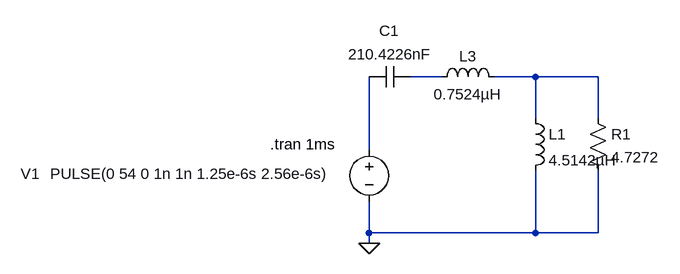
[diagram p0: schematic Resonant Tank Simulation.asc]
Resonant Tank Simulation.asc, the LTspice schematic file:
Version 4.1
SHEET 1 880 680
WIRE 224 -192 176 -192
WIRE 368 -192 304 -192
WIRE 464 -192 368 -192
WIRE 368 -128 368 -192
WIRE 464 -128 464 -192
WIRE 112 -80 112 -192
WIRE 112 48 112 0
WIRE 368 48 368 -48
WIRE 368 48 112 48
WIRE 464 48 464 -48
WIRE 464 48 368 48
WIRE 112 64 112 48
FLAG 112 64 0
SYMBOL voltage 112 -96 R0
WINDOW 0 -536 53 Left 2
WINDOW 3 -491 53 Left 2
WINDOW 123 0 0 Left 0
WINDOW 39 0 0 Left 0
SYMATTR InstName V1
SYMATTR Value PULSE(0 54 0 1n 1n 1.25e-6s 2.56e-6s)
SYMBOL cap 176 -208 R90
WINDOW 0 -39 33 VBottom 2
WINDOW 3 -34 31 VTop 2
SYMATTR InstName C1
SYMATTR Value 210.4226nF
SYMBOL ind 208 -176 R270
WINDOW 0 32 56 VTop 2
WINDOW 3 5 56 VBottom 2
SYMATTR InstName L3
SYMATTR Value 0.7524µH
SYMBOL ind 352 -144 R0
SYMATTR InstName L1
SYMATTR Value 4.5142µH
SYMBOL res 448 -144 R0
SYMATTR InstName R1
SYMATTR Value 4.7272
TEXT -40 -88 Left 2 !.tran 1ms

The netlist it stands for:
* Resonant Tank Simulation.asc
V1 N003 0 PULSE(0 54 0 1n 1n 1.25e-6s 2.56e-6s)
C1 N001 N003 210.4226nF
L3 N001 N002 0.7524µH
L1 N002 0 4.5142µH
R1 N002 0 4.7272
.tran 1ms
.backanno
.end